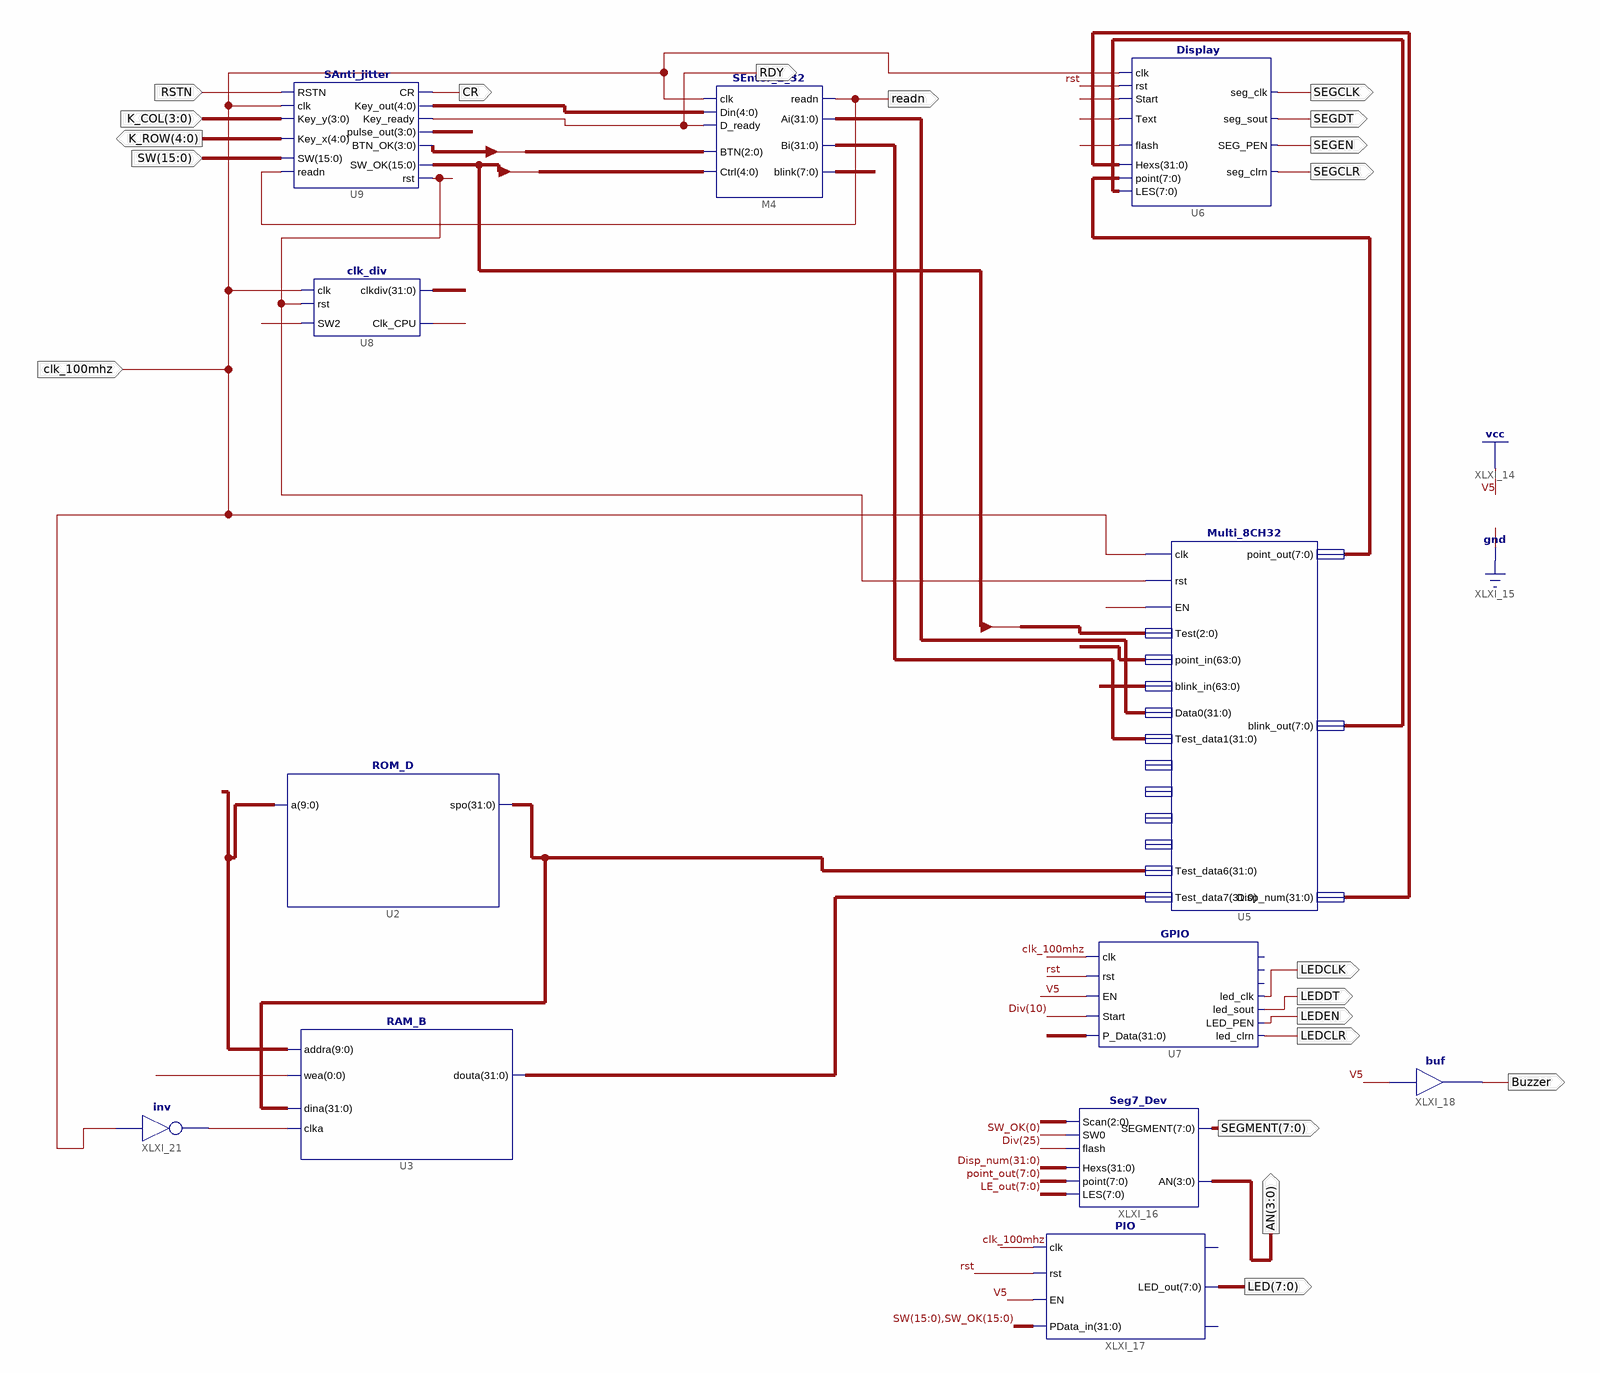
[diagram p0: schematic sheet 1]
// Xilinx ISE schematic OExp01_MUX.sch (kintex7) as structural Verilog: 12 symbols, 20 ports
module OExp01_MUX (
  input  [3:0] K_COL,
  input  [15:0] SW,
  input  RSTN,
  input  clk_100mhz,
  output CR,
  output RDY,
  output [4:0] K_ROW,
  output readn,
  output SEGCLK,
  output SEGDT,
  output SEGEN,
  output SEGCLR,
  output LEDCLK,
  output LEDDT,
  output LEDEN,
  output LEDCLR,
  output [7:0] LED,
  output [3:0] AN,
  output [7:0] SEGMENT,
  output Buzzer
);

  wire Clk_CPU, rst, XLXN_67;
  wire [3:0] BTN_OK, Pulse;
  wire [4:0] Key_out;
  wire [7:0] blink, LE_out, point_out;
  wire [15:0] SW_OK;
  wire [31:0] Ai, Bi, Disp_num, Div, XLXN_73, XLXN_74;

  Display U6 (
    .LES(LE_out), .SEG_PEN(SEGEN), .seg_sout(SEGDT), .seg_clrn(SEGCLR), .point(point_out), .Hexs(Disp_num),
    .Text(SW_OK[0]), .flash(Div[25]), .seg_clk(SEGCLK), .clk(clk_100mhz), .rst(rst), .Start(Div[10]));
  SAnti_jitter U9 (
    .SW(SW), .readn(readn), .Key_y(K_COL), .Key_x(K_ROW), .RSTN(RSTN), .clk(clk_100mhz), .Key_out(Key_out),
    .Key_ready(RDY), .CR(CR), .rst(rst), .SW_OK(SW_OK), .pulse_out(Pulse), .BTN_OK(BTN_OK));
  clk_div U8 (.rst(rst), .clk(clk_100mhz), .SW2(SW_OK[2]), .clkdiv(Div), .Clk_CPU(Clk_CPU));
  SEnter_2_32 M4 (
    .readn(readn), .Ai(Ai), .Bi(Bi), .blink(blink), .Din(Key_out), .D_ready(RDY), .clk(clk_100mhz),
    .Ctrl({SW_OK[7:5], SW_OK[15], SW_OK[0]}), .BTN(BTN_OK[2:0]));
  GPIO U7 (
    .clk(clk_100mhz), .P_Data({SW, SW_OK}), .rst(rst), .EN(1'b1), .Start(Div[10]), .led_clk(LEDCLK),
    .led_clrn(LEDCLR), .LED_PEN(LEDEN), .led_sout(LEDDT));  // open: GPIOf0, LED_out, counter_set
  Multi_8CH32 U5 (
    .clk(clk_100mhz), .rst(rst), .EN(1'b1), .Test(SW_OK[7:5]), .point_in({Div, Div}),
    .blink_in({{12{1'b0}}, blink[3:0], {32{1'b0}}, blink, blink}), .Data0(Ai), .Test_data1(Bi),
    .Test_data6(XLXN_74), .Test_data7(XLXN_73), .point_out(point_out), .blink_out(LE_out), .Disp_num(Disp_num));  // open: Test_data2, Test_data3, Test_data4, Test_data5
  Seg7_Dev XLXI_16 (
    .LES(LE_out), .Scan({SW_OK[1], Div[19:18]}), .SEGMENT(SEGMENT), .AN(AN), .point(point_out),
    .flash(Div[25]), .SW0(SW_OK[0]), .Hexs(Disp_num));
  PIO XLXI_17 (
    .clk(clk_100mhz), .rst(rst), .EN(1'b1), .PData_in({SW, SW_OK}), .LED_out(LED));  // open: GPIOf0, counter_set
  buf XLXI_18 (Buzzer, 1'b1);
  RAM_B U3 (.addra({{5{1'b0}}, SW[3], Div[27:24]}), .clka(XLXN_67), .wea(SW_OK[4]), .dina(XLXN_74), .douta(XLXN_73));
  not XLXI_21 (XLXN_67, clk_100mhz);
  ROM_D U2 (.a({{5{1'b0}}, SW[3], Div[27:24]}), .spo(XLXN_74));
endmodule
